# EAGLE design 8relais (EAGLE 5.00)
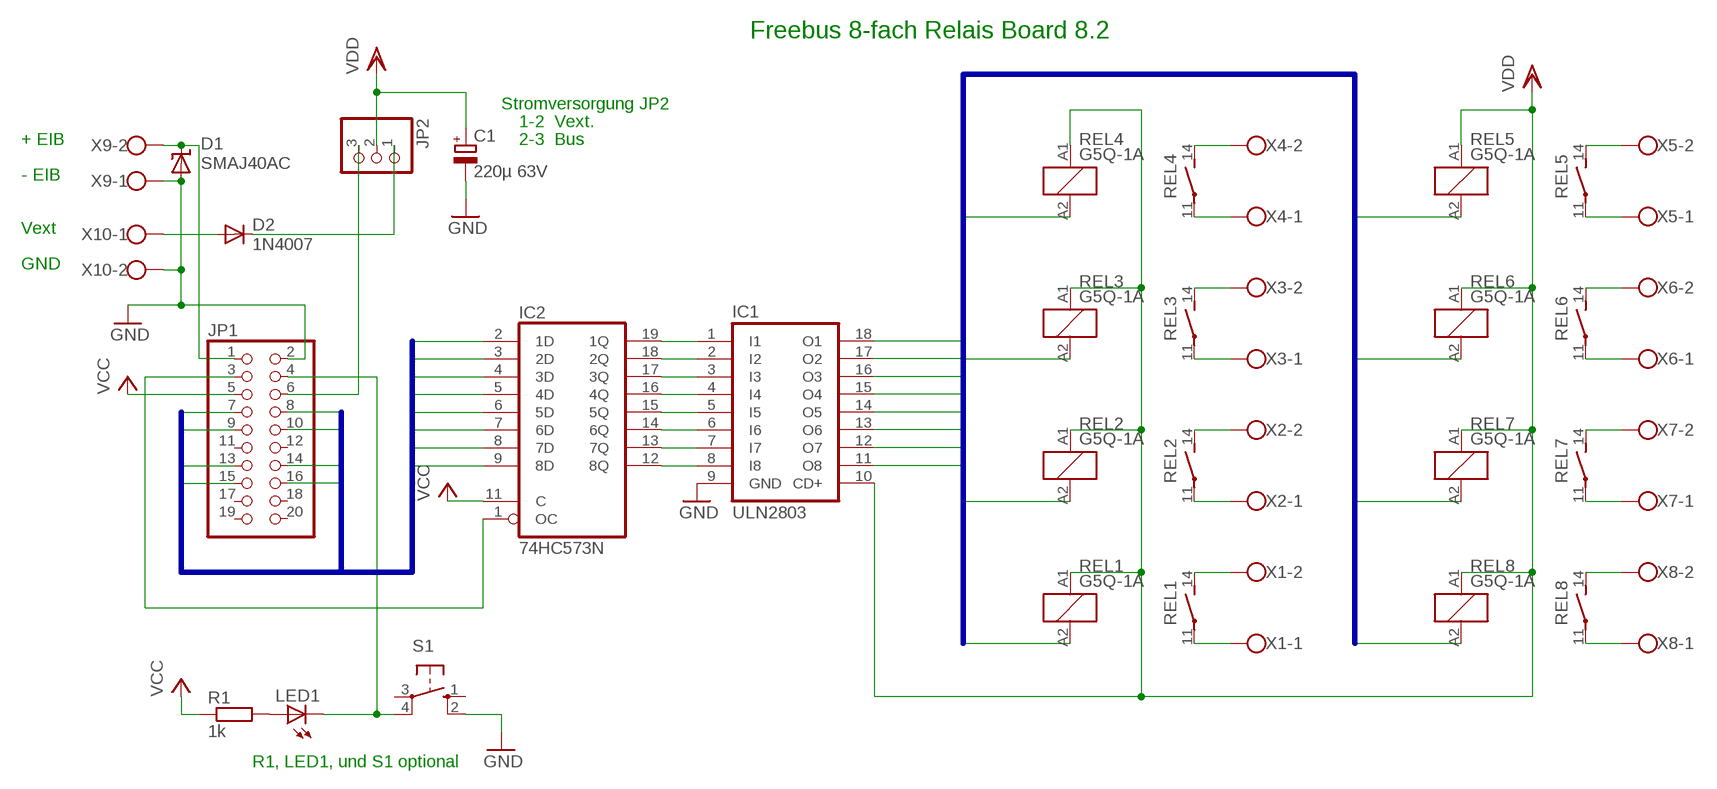
[diagram p0: schematic, sheet 1]

## Parts
C1  220µ 63V  CPOL-EUTT5D10  [TT5D10]
D1  SMAJ40AC  SUPPRESSOR-SMBJ  [SMBJ]
D2  1N4007  1N4004  [DO41-10]
IC1  ULN2803  ULN2803A  [DIL18]
IC2  74HC573N  [DIL20]
JP1  PINHD-2X10  [2X10]
JP2  PINHD-1X3  [1X03]
LED1  LED3MM  [LED3MM]
R1  1k  R-EU_0207/10  [0207/10]
REL1  G5Q-1A  RE030024  [RE-SCHRACK]
REL2  G5Q-1A  RE030024  [RE-SCHRACK]
REL3  G5Q-1A  RE030024  [RE-SCHRACK]
REL4  G5Q-1A  RE030024  [RE-SCHRACK]
REL5  G5Q-1A  RE030024  [RE-SCHRACK]
REL6  G5Q-1A  RE030024  [RE-SCHRACK]
REL7  G5Q-1A  RE030024  [RE-SCHRACK]
REL8  G5Q-1A  RE030024  [RE-SCHRACK]
S1  10-XX  [B3F-10XX]
X1  W237-102  [W237-102]
X2  W237-102  [W237-102]
X3  W237-102  [W237-102]
X4  W237-102  [W237-102]
X5  W237-102  [W237-102]
X6  W237-102  [W237-102]
X7  W237-102  [W237-102]
X8  W237-102  [W237-102]
X9  W237-102  [W237-102]
X10  W237-102  [W237-102]

## Nets
GND: C1.- D1.A IC1.9(GND) JP1.2 S1.2(S1) X9.1 X10.2
IO1: IC2.2(1D) JP1.16
IO2: IC2.3(2D) JP1.15
IO3: IC2.4(3D) JP1.14
IO4: IC2.5(4D) JP1.13
IO5: IC2.6(5D) JP1.10
IO6: IC2.7(6D) JP1.9
IO7: IC2.8(7D) JP1.8
IO8: IC2.9(8D) JP1.7
N$1: REL4.11(2:P) X4.1
N$2: REL4.14(2:S) X4.2
N$3: REL3.11(2:P) X3.1
N$4: REL3.14(2:S) X3.2
N$5: REL2.11(2:P) X2.1
N$6: REL2.14(2:S) X2.2
N$7: REL1.11(2:P) X1.1
N$8: REL1.14(2:S) X1.2
N$9: REL5.11(2:P) X5.1
N$10: REL6.11(2:P) X6.1
N$11: REL7.11(2:P) X7.1
N$12: REL8.11(2:P) X8.1
N$13: REL5.14(2:S) X5.2
N$14: REL6.14(2:S) X6.2
N$15: REL7.14(2:S) X7.2
N$16: REL8.14(2:S) X8.2
N$17: D2.A X10.1
N$18: JP1.6 JP2.3
N$19: LED1.A R1.2
N$20: D1.C JP1.1 X9.2
N$21: IC1.1(I1) IC2.19(1Q)
N$22: IC1.2(I2) IC2.18(2Q)
N$23: IC1.3(I3) IC2.17(3Q)
N$24: IC1.4(I4) IC2.16(4Q)
N$25: IC1.5(I5) IC2.15(5Q)
N$27: IC1.6(I6) IC2.14(6Q)
N$28: IC1.7(I7) IC2.13(7Q)
N$29: IC1.8(I8) IC2.12(8Q)
N$30: JP1.4 LED1.K(C) S1.4(P1)
N$31: D2.C JP2.1
N$33: IC2.1(OC) JP1.3
R1: IC1.14(O5) REL4.A2
R2: IC1.13(O6) REL3.A2
R3: IC1.12(O7) REL2.A2
R4: IC1.11(O8) REL1.A2
R5: IC1.15(O4) REL5.A2
R6: IC1.16(O3) REL6.A2
R7: IC1.17(O2) REL7.A2
R8: IC1.18(O1) REL8.A2
VCC: IC2.11(C) JP1.5 R1.1
VDD: C1.+ IC1.10(CD+) JP2.2 REL1.A1 REL2.A1 REL3.A1 REL4.A1 REL5.A1 REL6.A1 REL7.A1 REL8.A1
Unconnected: JP1.11 JP1.12 JP1.17 JP1.18 JP1.19 JP1.20 S1.1(S) S1.3(P)

## Buses
R[1..8]
IO[1..8]

## Notes on the sheet
- Freebus 8-fach Relais Board 8.2
- Stromversorgung JP2
- 1-2  Vext.
- + EIB | 2-3  Bus
- - EIB
- Vext
- GND
- R1, LED1, und S1 optional

## Power pins joined to a net without a drawn wire
GND: IC2.10(GND)
VCC: IC2.20(VCC)

## Library data of the parts
C1 = rcl:CPOL-EU: POLARIZED CAPACITOR, European symbol
D1 = diode:SUPPRESSOR-: Suppressor diode
D2 = diode:1N4004: DIODE general purpose rectifier, 1 A
IC1 = uln-udn:ULN2803A: DRIVER ARRAY
IC2 = 74xx-eu:74*573: 8-bit D latch BUS DRIVER
JP1 = pinhead:PINHD-2X10: PIN HEADER
JP2 = pinhead:PINHD-1X3: PIN HEADER
LED1 = led:LED: LED OSRAM: - CHIPLED LG R971, LG N971, LY N971, LG Q971, LY Q971, LO R971, LY R971 LH N974, LH R974 LS Q976, LO Q976, LY Q976 LO Q996 - Hyper CHIPLED LW Q18S LB Q993, LB Q99A, LB R99A - SideLED LS A670, LO A670, LY A670, LG A670, LP A670 LB A673, LV A673, LT A673, LW A673 LH A674 LY A675 LS A676, LA A676, LO A676, LY A676, LW A676 LS A679, LY A679, LG A679 - Hyper Micro SIDELED® LS Y876, LA Y876, LO Y876, LY Y876 LT Y87S - SmartLED LW L88C, LW L88S LB L89C, LB L89S, LG L890 LS L89K, LO L89K, LY L89K LS L896, LA L896, LO L896, LY L896 - TOPLED LS T670, LO T670, LY T670, LG T670, LP T670 LSG T670, LSP T670, LSY T670, LOP T670, LYG T670 LG T671, LOG T671, LSG T671 LB T673, LV T673, LT T673, LW T673 LH T674 LS T676, LA T676, LO T676, LY T676, LB T676, LH T676, LSB T676, LW T676 LB T67C, LV T67C, LT T67C, LS T67K, LO T67K, LY T67K, LW E67C LS E67B, LA E67B, LO E67B, LY E67B, LB E67C, LV E67C, LT E67C LW T67C LS T679, LY T679, LG T679 LS T770, LO T770, LY T770, LG T770, LP T770 LB T773, LV T773, LT T773, LW T773 LH T774 LS E675, LA E675, LY E675, LS T675 LS T776, LA T776, LO T776, LY T776, LB T776 LHGB T686 LT T68C, LB T68C - Hyper Mini TOPLED® LB M676 - Mini TOPLED Santana® LG M470 LS M47K, LO M47K, LY M47K Source: http://www.osram.convergy.de - LUMILED® LXK2-PW12-R00, LXK2-PW12-S00, LXK2-PW14-U00, LXK2-PW14-V00 LXK2-PM12-R00, LXK2-PM12-S00, LXK2-PM14-U00 LXK2-PE12-Q00, LXK2-PE12-R00, LXK2-PE12-S00, LXK2-PE14-T00, LXK2-PE14-U00 LXK2-PB12-K00, LXK2-PB12-L00, LXK2-PB12-M00, LXK2-PB14-N00, LXK2-PB14-P00, LXK2-PB14-Q00 LXK2-PR12-L00, LXK2-PR12-M00, LXK2-PR14-Q00, LXK2-PR14-R00 LXK2-PD12-Q00, LXK2-PD12-R00, LXK2-PD12-S00 LXK2-PH12-R00, LXK2-PH12-S00 LXK2-PL12-P00, LXK2-PL12-Q00, LXK2-PL12-R00 Source: www.luxeon.com
R1 = rcl:R-EU_: RESISTOR, European symbol
REL1-REL8 = relay:RE03*: Miniature PCB Relay 1 pole 6 A SCHRACK Source: http://www.schrack.com/.. 5812.pdf
S1 = switch-omron:10-XX: OMRON SWITCH
X1-X10 = con-wago-500:W237-102: WAGO SCREW CLAMP

## Board
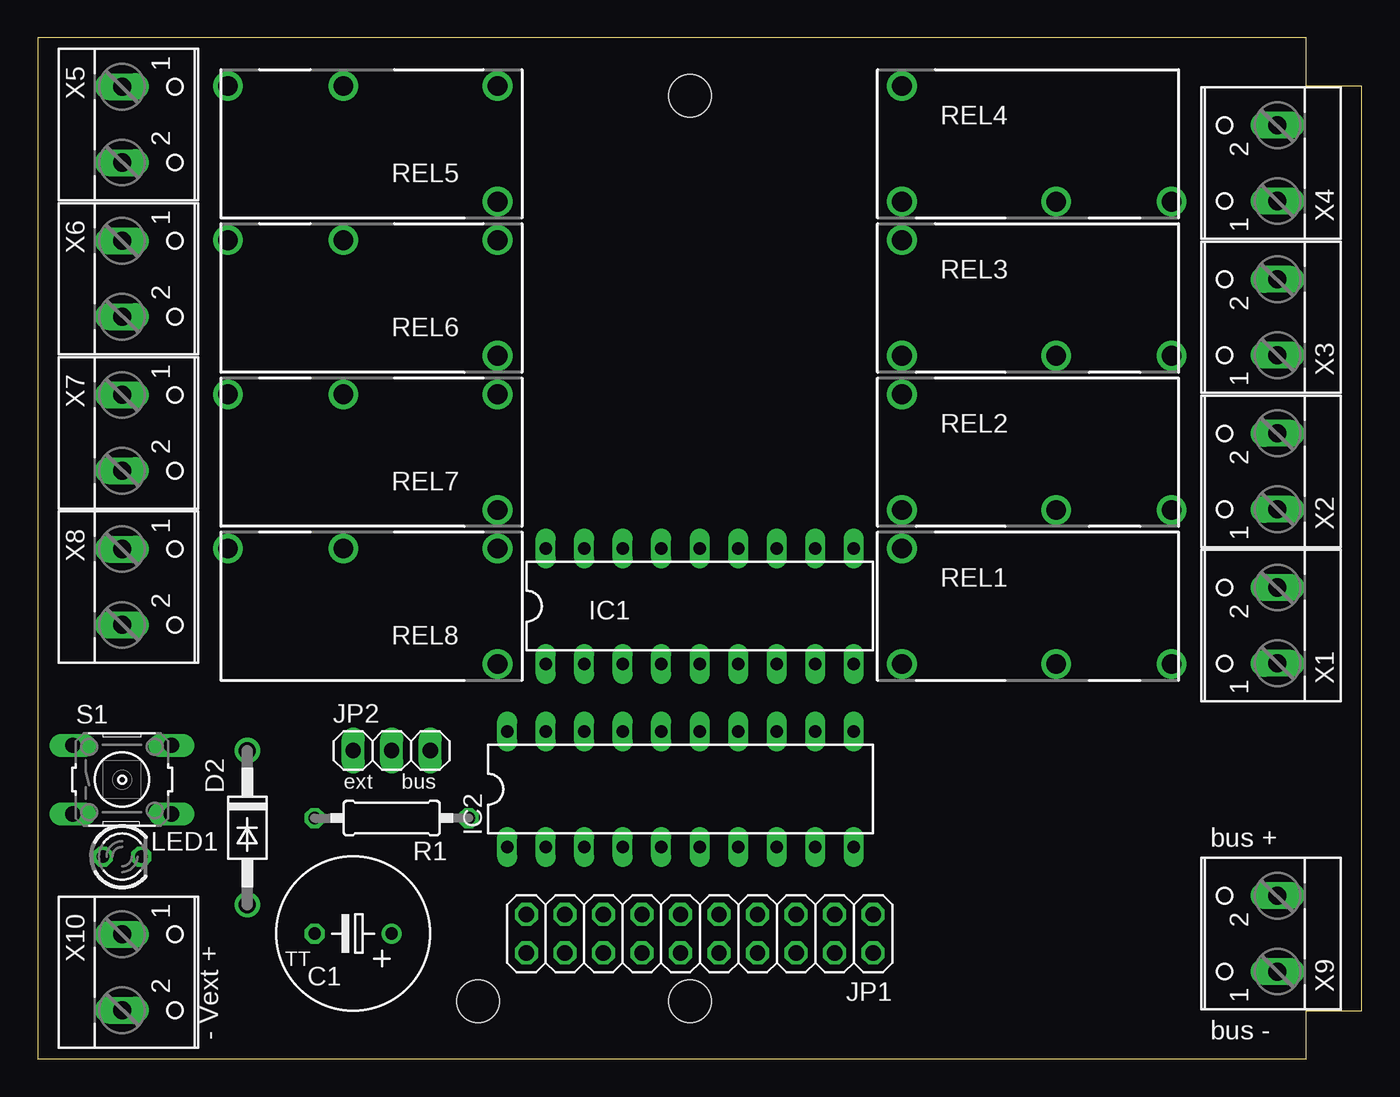
[diagram p1: board, top side]
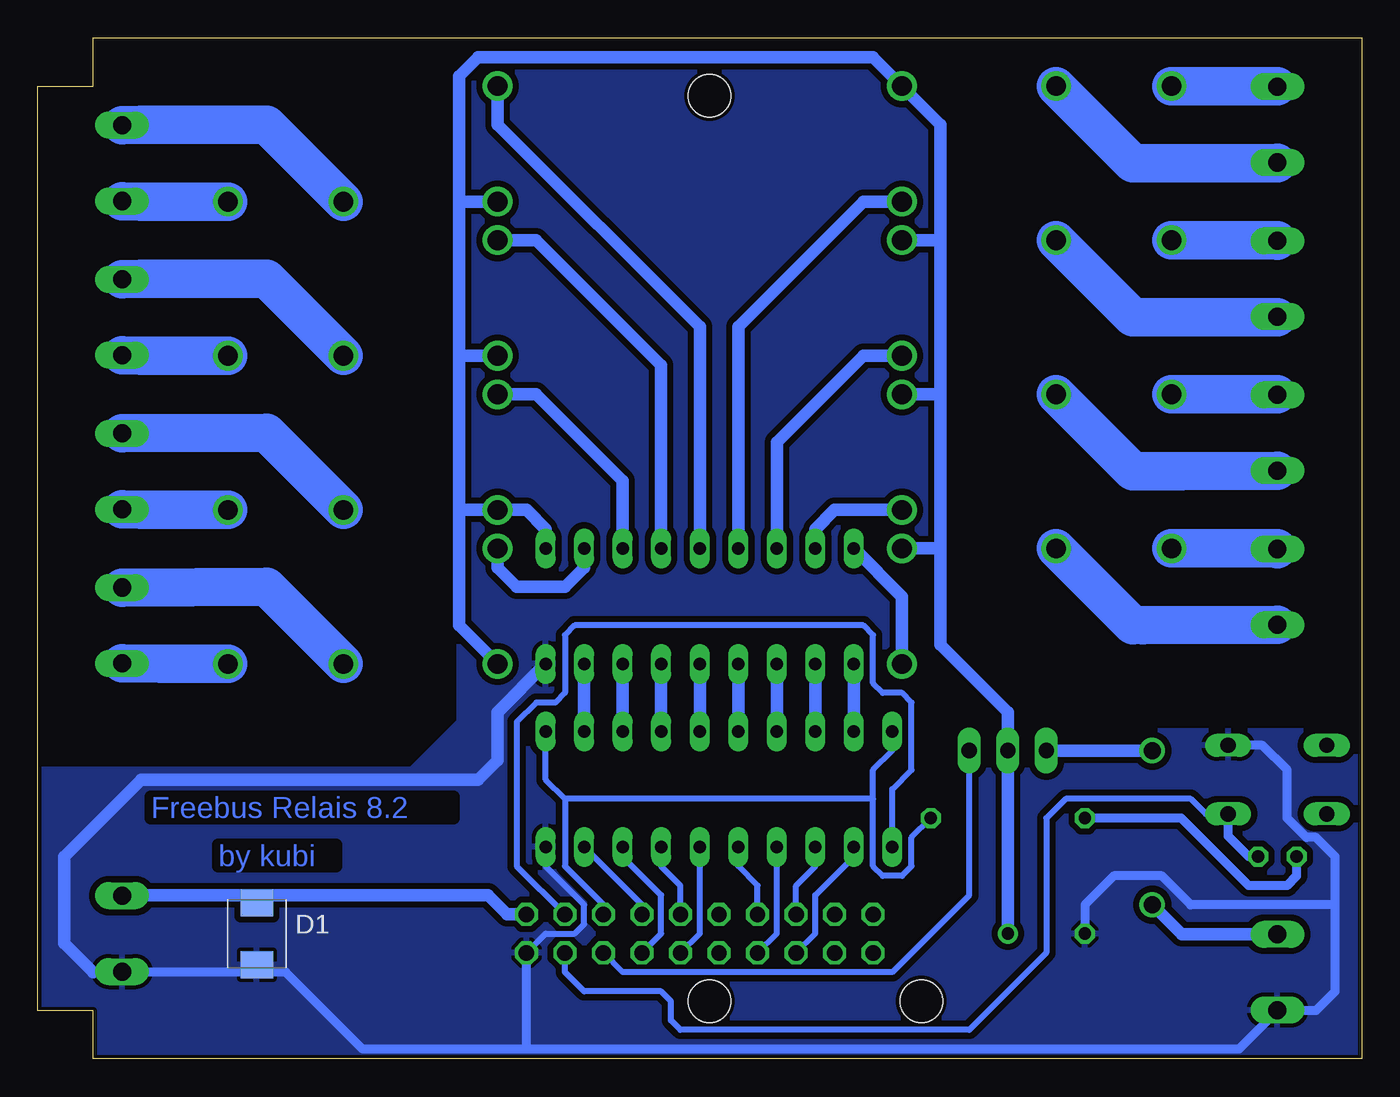
[diagram p2: board, bottom side, seen from below]

Size 87.3 x 67.31 mm. Coordinates in mm from the lower left corner, seen from the top.
Outline: 0,0.01 83.66,0 83.66,3.18 87.3,3.18 87.3,64.13 83.66,64.13 83.66,67.31 0,67.31 0,0.01
Copper layers (1*16): Top 0.035mm / dielectric 1.5mm / Bottom 0.035mm
Design rules "default *": minimum track width 10mil, minimum drill 24mil, track to track 16mil, track to pad 16mil, pad to pad 16mil, via to via 16mil, smd to smd 8mil, copper to edge 10mil, drill to drill 10mil, minimum pad ring 10mil, minimum via ring 8mil, stop-mask expansion 4mil, vias tented up to drill 0mil, thermal gap 10mil
Holes 2.8 mm at 43.02,3.81 43.02,63.5 29.04,3.81

### Footprints (pad centres in the part's own frame; a part is rotated, then mirrored left to right if it is on the bottom)
TT5D10 = drill 0.813 round: + -2.54,0 | drill 0.813 octagon: - 2.54,0
SMBJ = smd 1.78 x 2.16: A 2.04,0; C -2.03,0
DO41-10 = drill 1.118 round: A 5.08,0; C -5.08,0
DIL18 = drill 0.813 long: 1 -10.16,-3.81; 2 -7.62,-3.81; 3 -5.08,-3.81; 4 -2.54,-3.81; 5 0,-3.81; 6 2.54,-3.81; 7 5.08,-3.81; 8 7.62,-3.81; 9 10.16,-3.81; 10 10.16,3.81; 11 7.62,3.81; 12 5.08,3.81; 13 2.54,3.81; 14 0,3.81; 15 -2.54,3.81; 16 -5.08,3.81; 17 -7.62,3.81; 18 -10.16,3.81
DIL20 = drill 0.813 long: 1 -11.43,-3.81; 2 -8.89,-3.81; 3 -6.35,-3.81; 4 -3.81,-3.81; 5 -1.27,-3.81; 6 1.27,-3.81; 7 3.81,-3.81; 8 6.35,-3.81; 9 8.89,-3.81; 10 11.43,-3.81; 11 11.43,3.81; 12 8.89,3.81; 13 6.35,3.81; 14 3.81,3.81; 15 1.27,3.81; 16 -1.27,3.81; 17 -3.81,3.81; 18 -6.35,3.81; 19 -8.89,3.81; 20 -11.43,3.81
2X10 = drill 1.016 octagon: 1 -11.43,-1.27; 2 -11.43,1.27; 3 -8.89,-1.27; 4 -8.89,1.27; 5 -6.35,-1.27; 6 -6.35,1.27; 7 -3.81,-1.27; 8 -3.81,1.27; 9 -1.27,-1.27; 10 -1.27,1.27; 11 1.27,-1.27; 12 1.27,1.27; 13 3.81,-1.27; 14 3.81,1.27; 15 6.35,-1.27; 16 6.35,1.27; 17 8.89,-1.27; 18 8.89,1.27; 19 11.43,-1.27; 20 11.43,1.27
1X03 = drill 1.016 long: 1 -2.54,0; 2 0,0; 3 2.54,0
LED3MM = drill 0.813 octagon: A -1.27,0; K 1.27,0
0207/10 = drill 0.813 octagon: 1 -5.08,0; 2 5.08,0
RE-SCHRACK = drill 1.3 round: 11 8.89,-3.81; 14 1.27,-3.81; A1 -8.89,-3.81; A2 -8.89,3.81
B3F-10XX = drill 1.016 long: 1 -3.251,2.261; 2 3.251,2.261; 3 -3.251,-2.261; 4 3.251,-2.261
W237-102 = drill 1.194 long: 1 -2.5,-1.27; 2 2.5,-1.27

### Placement (x,y rotation side)
C1  20.79,8.26 180 top
D1  72.86,8.26 270 bottom
D2  13.81,15.24 270 top
IC1  43.65,29.85 0 top
IC2  42.38,17.78 0 top
JP1  43.65,8.26 180 top
JP2  23.33,20.32 0 top
LED1  5.55,13.33 0 top
R1  23.33,15.88 180 top
REL1  65.88,29.85 0 top
REL2  65.88,40 0 top
REL3  65.88,50.16 0 top
REL4  65.88,60.32 0 top
REL5  21.42,60.32 180 top
REL6  21.42,50.16 180 top
REL7  21.42,40 180 top
REL8  21.42,29.85 180 top
S1  5.55,18.42 0 top
X1  80.48,28.58 90 top
X2  80.48,38.73 90 top
X3  80.48,48.89 90 top
X4  80.48,59.05 90 top
X5  6.82,61.59 270 top
X6  6.82,51.43 270 top
X7  6.82,41.27 270 top
X8  6.82,31.12 270 top
X9  80.48,8.26 90 top
X10  6.82,5.71 270 top

### Tracks (layer width: path | path; a pad name or v marks a point on that pad's centre or on a via)
GND
  Bottom 0.406: IC2.10 53.81,12.7 51.27,10.16 51.27,8.89 51.91,8.26 53.81,8.26 JP1.2
  Bottom 0.61: 55.08,0.64 8.09,0.64 5.55,3.17 3.01,3.17 1.74,4.45 1.74,10.16 | 55.08,0.64 65.88,0.64 70.95,5.71 | 55.08,0.64 JP1.2 | 70.95,5.71 X9.1 | 70.95,5.71 83.66,5.71 | S1.2 6.54,20.68 4.92,19.05 4.92,15.88 3.64,14.61 3.01,14.61 1.74,13.33 1.74,10.16 | C1.- 18.25,10.16 16.34,12.06 13.17,12.06 11.27,10.16 1.74,10.16
  Bottom 0.813: 83.66,5.71 85.56,7.62 85.56,13.33 80.48,18.42 58.25,18.42 56.98,19.69 56.98,22.86 IC1.9 | 5.55,3.17 X10.2
  pour Bottom: -0.17,0 -0.17,21.59 22.7,21.59 27.77,26.67 27.77,66.04 59.52,66.04 59.52,22.23 62.7,19.05 87.47,19.05 87.47,0
IO1
  Bottom 0.406: JP1.16 36.03,8.26 36.03,10.79 33.49,13.33 IC2.2
IO2
  Bottom 0.406: JP1.15 37.3,11.43 36.03,12.7 IC2.3
IO3
  Bottom 0.406: JP1.14 38.57,8.26 IC2.4
IO4
  Bottom 0.406: JP1.13 39.84,11.43 41.11,12.7 IC2.5
IO5
  Bottom 0.406: JP1.10 43.65,8.26 IC2.6
IO6
  Bottom 0.406: JP1.9 44.92,11.43 46.19,12.7 IC2.7
IO7
  Bottom 0.406: JP1.8 46.19,8.26 46.19,10.79 48.73,13.33 IC2.8
IO8
  Bottom 0.406: JP1.7 47.46,10.16 IC2.9
N$1
  Bottom 2.54: X4.1 80.48,56.52 REL4.11
N$2
  Bottom 2.54: REL4.14 72.22,61.59 80.48,61.59 X4.2
N$3
  Bottom 2.54: X3.1 80.48,46.35 REL3.11
N$4
  Bottom 2.54: REL3.14 72.22,51.43 80.48,51.43 X3.2
N$5
  Bottom 2.54: X2.1 80.48,36.2 REL2.11
N$6
  Bottom 2.54: X2.2 72.22,41.27 REL2.14
N$7
  Bottom 2.54: X1.1 79.21,26.04 REL1.11
N$8
  Bottom 2.54: X1.2 72.22,31.12 REL1.14
N$9
  Bottom 1.778: X5.1 5.55,64.14
  Bottom 2.54: 5.55,64.14 REL5.11
N$10
  Bottom 2.54: X6.1 5.55,53.98 REL6.11
N$11
  Bottom 0.254: X7.1 5.55,43.81
  Bottom 2.54: 5.55,43.81 REL7.11
N$12
  Bottom 2.54: REL8.11 5.55,33.66 X8.1
N$13
  Bottom 2.54: REL5.14 15.08,59.05 5.55,59.05 X5.2
N$14
  Bottom 1.778: X6.2 5.55,48.89
  Bottom 2.54: REL6.14 15.08,48.89 5.55,48.89
N$15
  Bottom 2.54: REL7.14 15.08,38.73 11.9,38.73 X7.2
N$16
  Bottom 1.778: 14.44,28.58 15.08,28.58
  Bottom 2.54: 15.08,28.58 REL8.14 | X8.2 14.44,28.58
N$17
  Bottom 0.813: X10.1 11.86,8.21 D2.A
N$18
  Bottom 0.406: JP1.6 48.73,5.71 30.95,5.71 25.87,10.79 JP2.3
N$19
  Bottom 0.61: R1.2 11.9,15.88 7.46,11.43 4.92,11.43 4.28,12.06 LED1.A
N$20
  Bottom 0.254: X9.2 81.75,10.79
  Bottom 0.406: 72.86,10.79 D1.C
  Bottom 0.61: 80.44,10.75 80.48,10.75 80.48,10.79
  Bottom 0.813: 80.48,10.75 X9.2 | JP1.1 56.35,9.53 57.62,10.79 72.86,10.79 80.48,10.79
N$21
  Bottom 0.813: IC2.19 IC1.1
N$22
  Bottom 0.813: IC2.18 IC1.2
N$23
  Bottom 0.813: IC2.17 IC1.3
N$24
  Bottom 0.813: IC2.16 IC1.4
N$25
  Bottom 0.813: IC2.15 IC1.5
N$27
  Bottom 0.813: IC2.14 IC1.6
N$28
  Bottom 0.813: IC2.13 IC1.7
N$29
  Bottom 0.813: IC2.12 IC1.8
N$30
  Bottom 0.406: JP1.4 52.54,5.71 51.27,4.45 46.19,4.45 45.55,3.81 45.55,2.54 44.92,1.91 25.87,1.91 20.79,6.98 20.79,15.88 19.52,17.15 11.27,17.15 10.27,16.15 S1.4
  Bottom 0.61: LED1.K 7.46,13.33 8.8,14.68 S1.4
N$31
  Bottom 0.813: D2.C JP2.1
N$33
  Bottom 0.406: JP1.3 55.71,12.7 55.71,22.23 54.45,23.5 53.17,23.5 52.54,24.13 52.54,27.94 51.91,28.58 32.85,28.58 32.22,27.94 32.22,24.77 31.58,24.13 30.31,24.13 29.68,23.5 29.68,19.05 30.95,17.78 IC2.1
R1
  Bottom 0.813: REL4.A2 56.98,61.59 43.65,48.26 IC1.14
R2
  Bottom 0.813: REL3.A2 54.45,53.98 46.19,45.72 IC1.13
R3
  Bottom 0.813: REL2.A2 54.45,43.81 48.73,38.1 IC1.12
R4
  Bottom 0.813: REL1.A2 56.98,32.38 55.71,31.12 52.54,31.12 51.27,32.38 IC1.11
R5
  Bottom 0.813: REL5.A2 32.85,56.52 41.11,48.26 IC1.15
R6
  Bottom 0.813: REL6.A2 32.85,46.35 38.57,40.64 IC1.16
R7
  Bottom 0.813: REL7.A2 34.76,36.2 36.03,34.92 IC1.17
R8
  Bottom 0.813: REL8.A2 30.31,30.48 IC1.18
VCC
  Bottom 0.406: IC2.20 30.95,20.32 32.22,19.05 32.22,17.15 | 52.54,17.15 52.54,12.7 50,10.16 JP1.5 | R1.1 29.68,14.61 29.68,12.7 30.31,12.06 31.58,12.06 32.22,12.7 32.22,17.15 | 32.22,17.15 52.54,17.15 | 52.54,17.15 53.81,18.42 IC2.11
VDD
  Bottom 0.813: 27.77,33.66 REL8.A1 | 27.77,33.66 27.77,43.81 | 27.77,43.81 REL7.A1 | 27.77,43.81 27.77,53.98 | 27.77,53.98 REL6.A1 | 27.77,53.98 27.77,61.59 REL5.A1 32.22,66.04 58.25,66.04 59.52,64.77 59.52,56.52 | 59.52,56.52 59.52,46.35 | 59.52,46.35 59.52,36.2 | 59.52,36.2 59.52,28.58 REL1.A1 | 59.52,36.2 REL2.A1 55.08,36.2 53.81,34.92 IC1.10 | 59.52,46.35 REL3.A1 | 59.52,56.52 REL4.A1 | 27.77,33.66 27.77,27.31 23.33,22.86 JP2.2 C1.+

### Text on the board
Bottom: Freebus Relais 8.2 | by kubi
tPlace: ext | bus | bus + | - Vext + | bus -